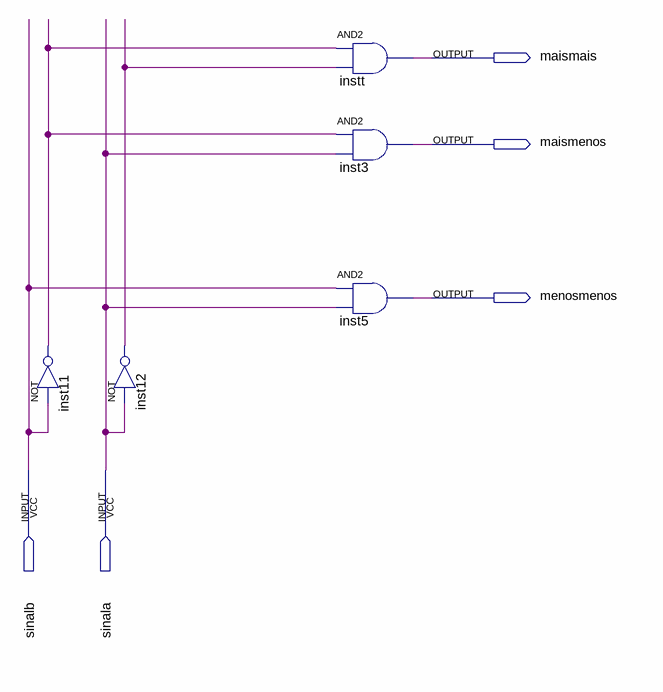
[diagram p0: schematic sheet]
// Quartus schematic demux2x4.bdf as structural Verilog: 5 symbols, 5 pins
module demux2x4 (
  input  sinalb,
  input  sinala,
  output maismais,
  output maismenos,
  output menosmenos
);

  wire inst11_out, inst12_out;

  not inst11 (inst11_out, sinalb);
  not inst12 (inst12_out, sinala);
  and instt (maismais, inst11_out, inst12_out);
  and inst3 (maismenos, inst11_out, sinala);
  and inst5 (menosmenos, sinalb, sinala);
endmodule
